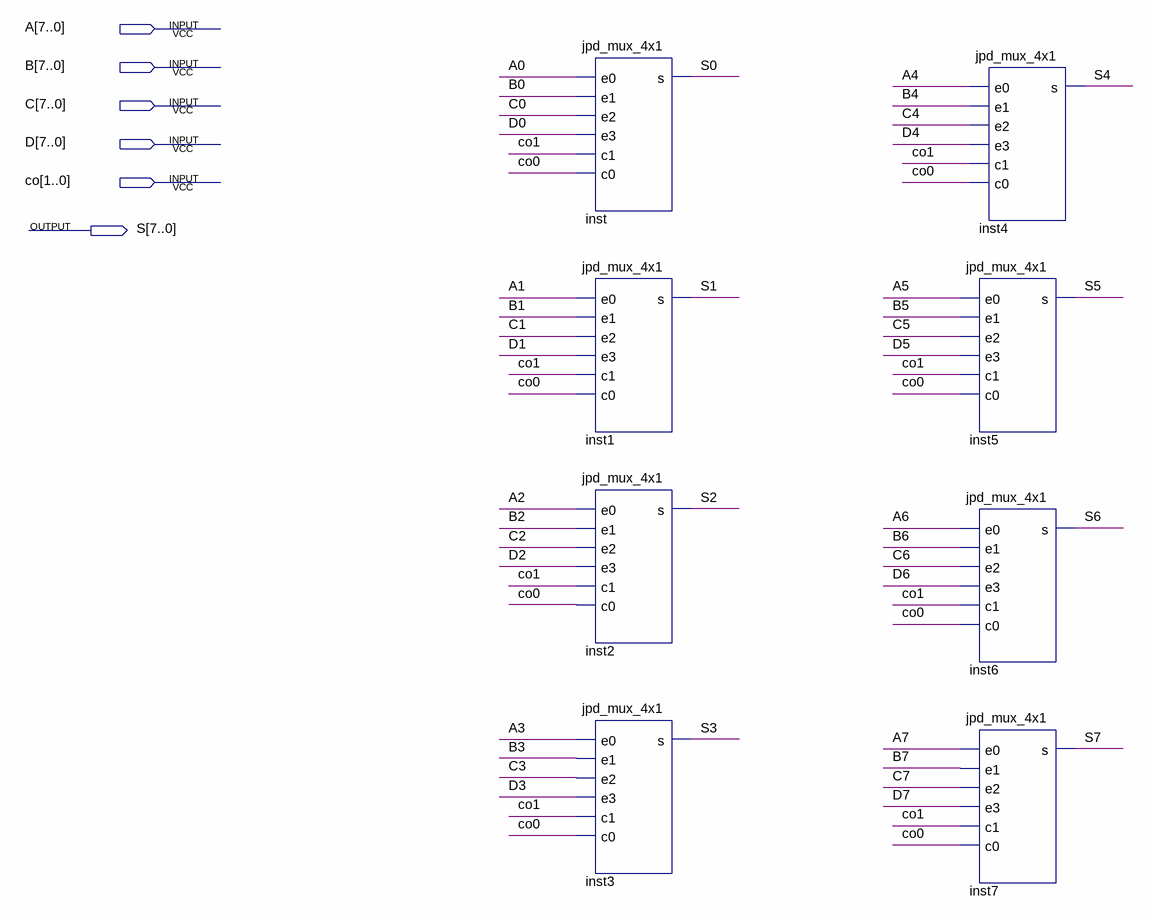
[diagram p0: schematic sheet]
// Quartus schematic jpd_mux_4x1_8bit.bdf as structural Verilog: 8 symbols, 6 pins
module jpd_mux_4x1_8bit (
  input  [7:0] A,
  input  [7:0] B,
  input  [7:0] C,
  input  [7:0] D,
  input  [1:0] co,
  output [7:0] S
);

  jpd_mux_4x1 inst (.e0(A[0]), .e1(B[0]), .e2(C[0]), .e3(D[0]), .c1(co[1]), .c0(co[0]), .s(S[0]));
  jpd_mux_4x1 inst1 (.e0(A[1]), .e1(B[1]), .e2(C[1]), .e3(D[1]), .c1(co[1]), .c0(co[0]), .s(S[1]));
  jpd_mux_4x1 inst2 (.e0(A[2]), .e1(B[2]), .e2(C[2]), .e3(D[2]), .c1(co[1]), .c0(co[0]), .s(S[2]));
  jpd_mux_4x1 inst3 (.e0(A[3]), .e1(B[3]), .e2(C[3]), .e3(D[3]), .c1(co[1]), .c0(co[0]), .s(S[3]));
  jpd_mux_4x1 inst5 (.e0(A[5]), .e1(B[5]), .e2(C[5]), .e3(D[5]), .c1(co[1]), .c0(co[0]), .s(S[5]));
  jpd_mux_4x1 inst6 (.e0(A[6]), .e1(B[6]), .e2(C[6]), .e3(D[6]), .c1(co[1]), .c0(co[0]), .s(S[6]));
  jpd_mux_4x1 inst7 (.e0(A[7]), .e1(B[7]), .e2(C[7]), .e3(D[7]), .c1(co[1]), .c0(co[0]), .s(S[7]));
  jpd_mux_4x1 inst4 (.e0(A[4]), .e1(B[4]), .e2(C[4]), .e3(D[4]), .c1(co[1]), .c0(co[0]), .s(S[4]));
endmodule
